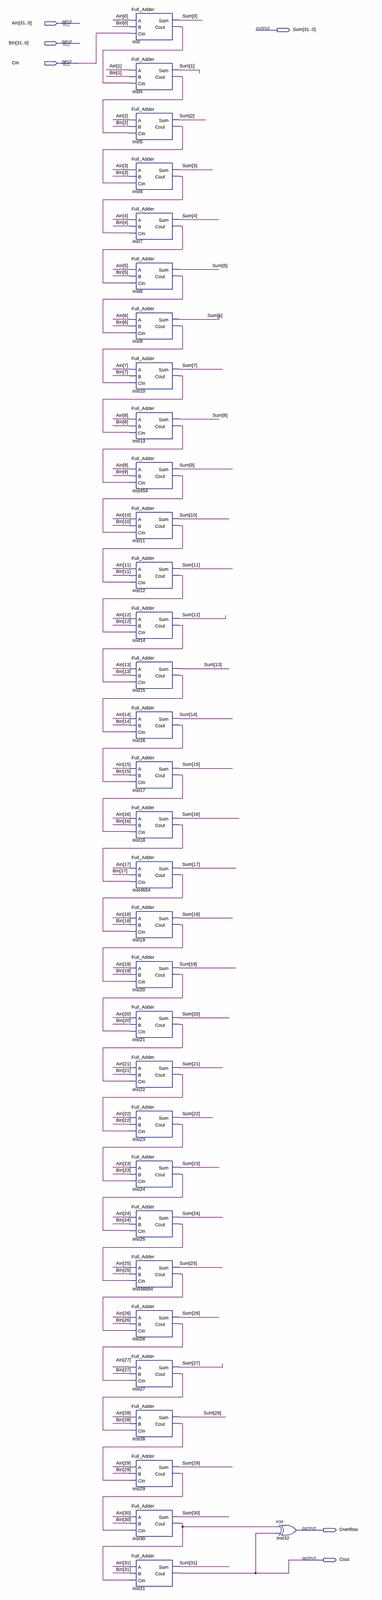
[diagram p0: schematic sheet, whole]
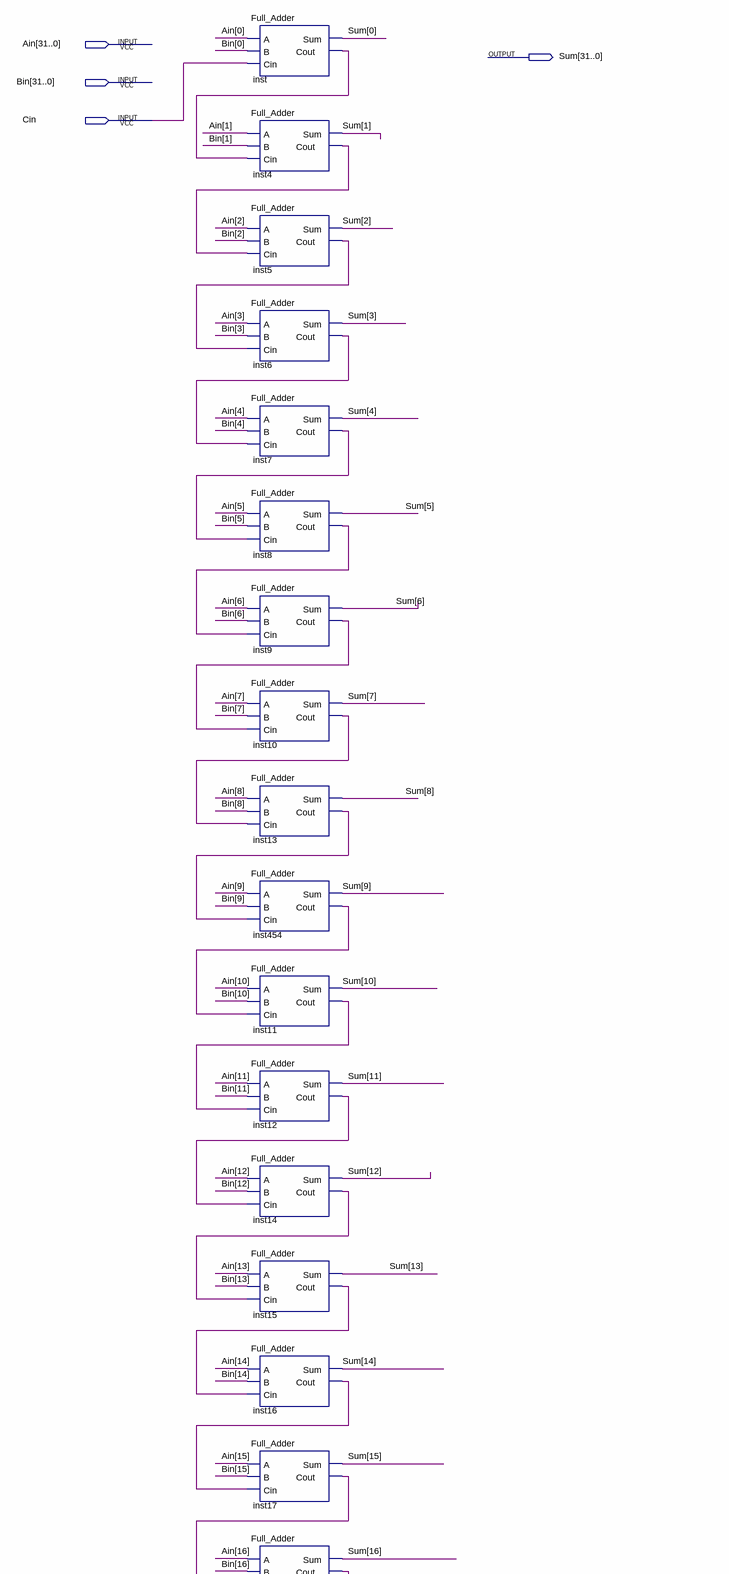
[diagram p1: schematic sheet, upper part]
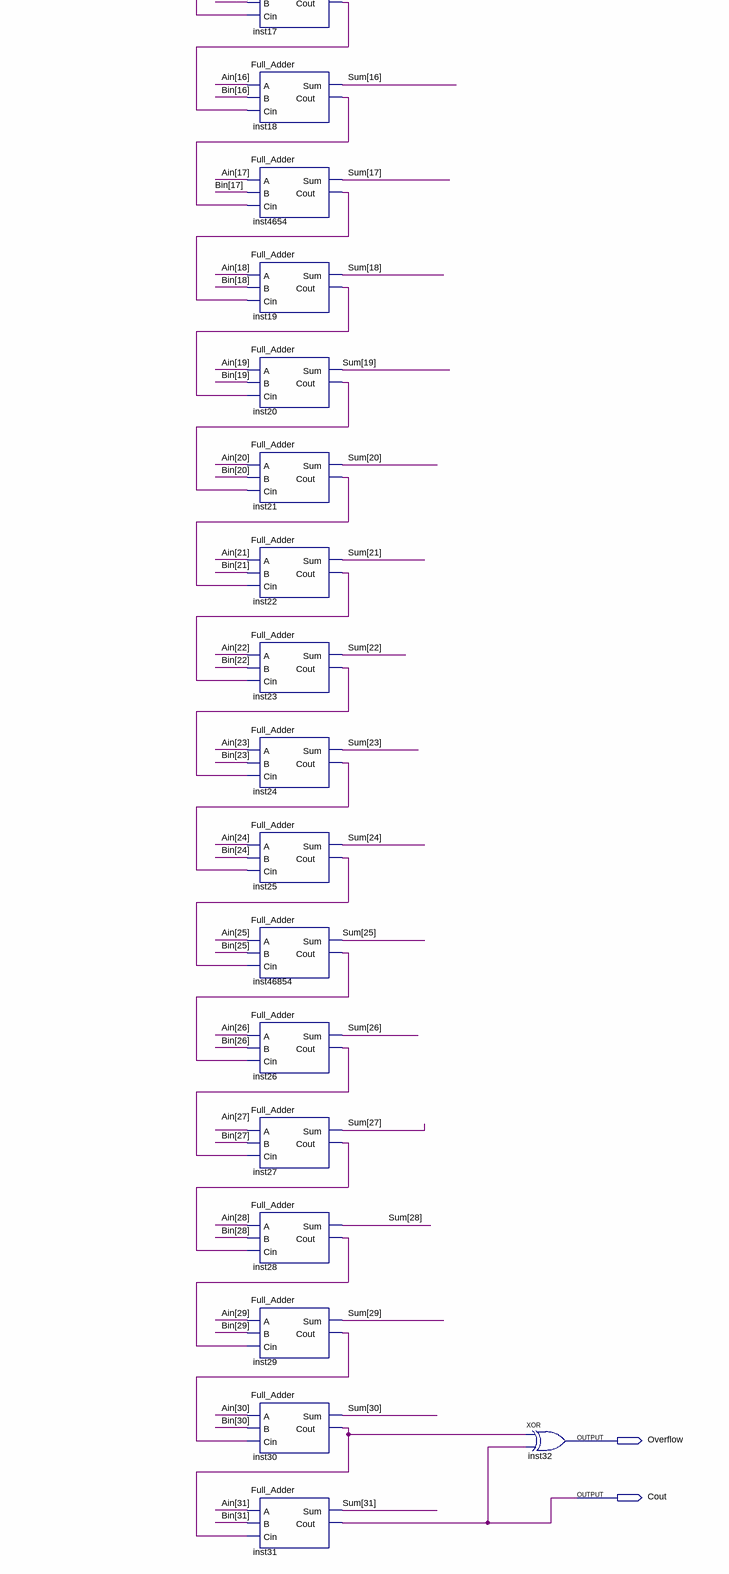
[diagram p2: schematic sheet, lower part]
// Quartus schematic Adder32.bdf as structural Verilog: 33 symbols, 6 pins
module Adder32 (
  input  [31:0] Ain,
  input  [31:0] Bin,
  input  Cin,
  output [31:0] Sum,
  output Overflow,
  output Cout
);

  wire inst4_cout, inst5_cout, inst6_cout, inst7_cout, inst8_cout, inst9_cout, inst10_cout, inst11_cout,
       inst12_cout, inst13_cout, inst14_cout, inst15_cout, inst16_cout, inst17_cout, inst18_cout,
       inst19_cout, inst20_cout, inst21_cout, inst22_cout, inst23_cout, inst24_cout, inst25_cout,
       inst26_cout, inst27_cout, inst28_cout, inst29_cout, inst30_cout, inst454_cout, inst4654_cout,
       inst46854_cout, inst_cout;

  Full_Adder inst (.A(Ain[0]), .B(Bin[0]), .Cin(Cin), .Sum(Sum[0]), .Cout(inst_cout));
  Full_Adder inst4 (.A(Ain[1]), .B(Bin[1]), .Cin(inst_cout), .Sum(Sum[1]), .Cout(inst4_cout));
  Full_Adder inst5 (.A(Ain[2]), .B(Bin[2]), .Cin(inst4_cout), .Sum(Sum[2]), .Cout(inst5_cout));
  Full_Adder inst6 (.A(Ain[3]), .B(Bin[3]), .Cin(inst5_cout), .Sum(Sum[3]), .Cout(inst6_cout));
  Full_Adder inst7 (.A(Ain[4]), .B(Bin[4]), .Cin(inst6_cout), .Sum(Sum[4]), .Cout(inst7_cout));
  Full_Adder inst8 (.A(Ain[5]), .B(Bin[5]), .Cin(inst7_cout), .Sum(Sum[5]), .Cout(inst8_cout));
  Full_Adder inst9 (.A(Ain[6]), .B(Bin[6]), .Cin(inst8_cout), .Sum(Sum[6]), .Cout(inst9_cout));
  Full_Adder inst10 (.A(Ain[7]), .B(Bin[7]), .Cin(inst9_cout), .Sum(Sum[7]), .Cout(inst10_cout));
  Full_Adder inst13 (.A(Ain[8]), .B(Bin[8]), .Cin(inst10_cout), .Sum(Sum[8]), .Cout(inst13_cout));
  Full_Adder inst454 (.A(Ain[9]), .B(Bin[9]), .Cin(inst13_cout), .Sum(Sum[9]), .Cout(inst454_cout));
  Full_Adder inst11 (.A(Ain[10]), .B(Bin[10]), .Cin(inst454_cout), .Sum(Sum[10]), .Cout(inst11_cout));
  Full_Adder inst12 (.A(Ain[11]), .B(Bin[11]), .Cin(inst11_cout), .Sum(Sum[11]), .Cout(inst12_cout));
  Full_Adder inst14 (.A(Ain[12]), .B(Bin[12]), .Cin(inst12_cout), .Sum(Sum[12]), .Cout(inst14_cout));
  Full_Adder inst15 (.A(Ain[13]), .B(Bin[13]), .Cin(inst14_cout), .Sum(Sum[13]), .Cout(inst15_cout));
  Full_Adder inst16 (.A(Ain[14]), .B(Bin[14]), .Cin(inst15_cout), .Sum(Sum[14]), .Cout(inst16_cout));
  Full_Adder inst17 (.A(Ain[15]), .B(Bin[15]), .Cin(inst16_cout), .Sum(Sum[15]), .Cout(inst17_cout));
  Full_Adder inst18 (.A(Ain[16]), .B(Bin[16]), .Cin(inst17_cout), .Sum(Sum[16]), .Cout(inst18_cout));
  Full_Adder inst4654 (.A(Ain[17]), .B(Bin[17]), .Cin(inst18_cout), .Sum(Sum[17]), .Cout(inst4654_cout));
  Full_Adder inst19 (.A(Ain[18]), .B(Bin[18]), .Cin(inst4654_cout), .Sum(Sum[18]), .Cout(inst19_cout));
  Full_Adder inst20 (.A(Ain[19]), .B(Bin[19]), .Cin(inst19_cout), .Sum(Sum[19]), .Cout(inst20_cout));
  Full_Adder inst21 (.A(Ain[20]), .B(Bin[20]), .Cin(inst20_cout), .Sum(Sum[20]), .Cout(inst21_cout));
  Full_Adder inst22 (.A(Ain[21]), .B(Bin[21]), .Cin(inst21_cout), .Sum(Sum[21]), .Cout(inst22_cout));
  Full_Adder inst23 (.A(Ain[22]), .B(Bin[22]), .Cin(inst22_cout), .Sum(Sum[22]), .Cout(inst23_cout));
  Full_Adder inst24 (.A(Ain[23]), .B(Bin[23]), .Cin(inst23_cout), .Sum(Sum[23]), .Cout(inst24_cout));
  Full_Adder inst25 (.A(Ain[24]), .B(Bin[24]), .Cin(inst24_cout), .Sum(Sum[24]), .Cout(inst25_cout));
  Full_Adder inst46854 (.A(Ain[25]), .B(Bin[25]), .Cin(inst25_cout), .Sum(Sum[25]), .Cout(inst46854_cout));
  Full_Adder inst26 (.A(Ain[26]), .B(Bin[26]), .Cin(inst46854_cout), .Sum(Sum[26]), .Cout(inst26_cout));
  Full_Adder inst27 (.A(Ain[27]), .B(Bin[27]), .Cin(inst26_cout), .Sum(Sum[27]), .Cout(inst27_cout));
  Full_Adder inst28 (.A(Ain[28]), .B(Bin[28]), .Cin(inst27_cout), .Sum(Sum[28]), .Cout(inst28_cout));
  Full_Adder inst29 (.A(Ain[29]), .B(Bin[29]), .Cin(inst28_cout), .Sum(Sum[29]), .Cout(inst29_cout));
  Full_Adder inst30 (.A(Ain[30]), .B(Bin[30]), .Cin(inst29_cout), .Sum(Sum[30]), .Cout(inst30_cout));
  Full_Adder inst31 (.A(Ain[31]), .B(Bin[31]), .Cin(inst30_cout), .Sum(Sum[31]), .Cout(Cout));
  xor inst32 (Overflow, inst30_cout, Cout);
endmodule
